# Altium project interface_com_usuario.PrjPcb
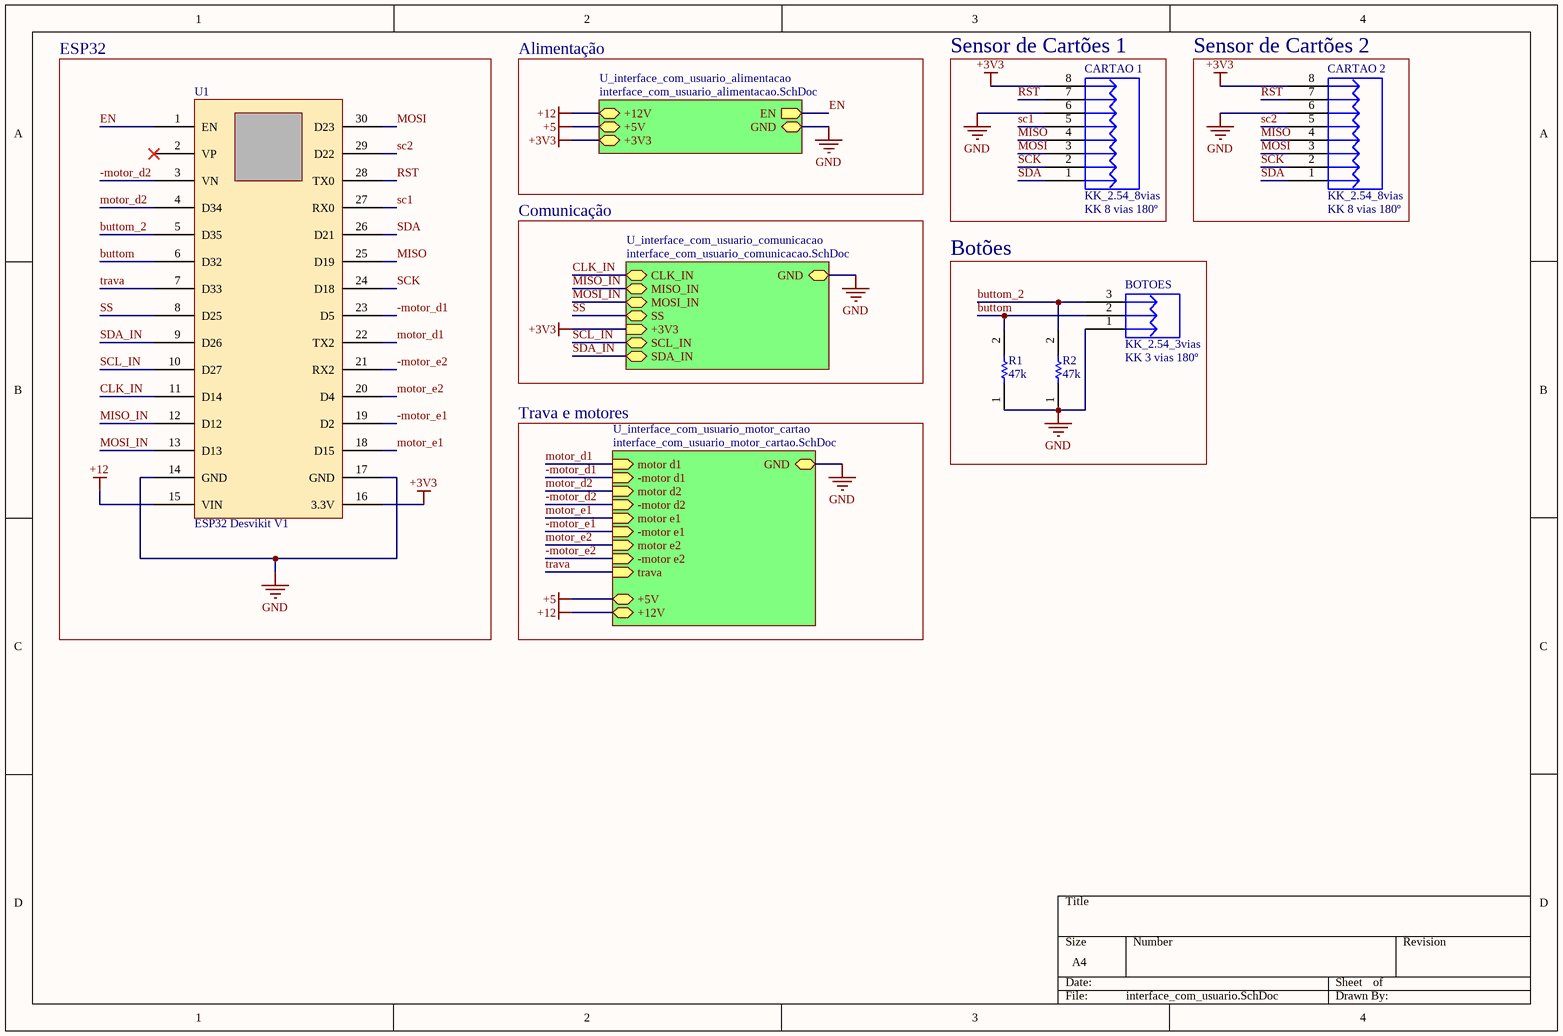
[diagram p0: interface_com_usuario.SchDoc]
4 sheets, 31 parts. Net scope: hierarchical (ports join the sheet entries above them; power ports are global).
Board file: interface_com_usuario.PcbDoc
Sheets:
  interface_com_usuario.SchDoc
    U_interface_com_usuario_alimentacao = interface_com_usuario_alimentacao.SchDoc
    U_interface_com_usuario_comunicacao = interface_com_usuario_comunicacao.SchDoc
    U_interface_com_usuario_motor_cartao = interface_com_usuario_motor_cartao.SchDoc

## Sheet interface_com_usuario.SchDoc
size A4; SheetNumber: 1; SheetTotal: 4

### Parts
BOTOES  KK_2.54_3vias  Valor: KK 3 vias 180º  [KK_3vias_180º]
CARTAO_1  KK_2.54_8vias  Valor: KK 8 vias 180º  [KK_8vias_180°]
CARTAO_2  KK_2.54_8vias  Valor: KK 8 vias 180º  [KK_8vias_180°]
R1  47k  [RESC3216X60N]
R2  47k  [RESC3216X60N]
U1  value ESP32 Desvikit V1  [ESP32_Desvikit_v1]  (hidden comment: microcontrolador)

### Blocks framed on the sheet
ESP32: U1
Sensor de Cartões 1: CARTAO_1
Sensor de Cartões 2: CARTAO_2
Botões: BOTOES R1 R2

### Sub-sheets
U_interface_com_usuario_alimentacao = interface_com_usuario_alimentacao.SchDoc: EN (out), GND (bidir), +12V (bidir), +5V (bidir), +3V3 (bidir)
U_interface_com_usuario_comunicacao = interface_com_usuario_comunicacao.SchDoc: CLK_IN (bidir), MISO_IN (bidir), MOSI_IN (bidir), SS (bidir), GND (bidir), +3V3 (in), SCL_IN (bidir), SDA_IN (bidir)
U_interface_com_usuario_motor_cartao = interface_com_usuario_motor_cartao.SchDoc: motor d1 (in), -motor d1 (in), motor d2 (in), -motor d2 (in), motor e1 (in), -motor e1 (in), motor e2 (in), -motor e2 (in), trava (in), GND (bidir), +5V (bidir), +12V (bidir)

### Nets
+3V3: CARTAO_1.8 CARTAO_2.8 U1.16(3.3V) ; sheet U_interface_com_usuario_alimentacao/+3V3, sheet U_interface_com_usuario_comunicacao/+3V3
+5: sheet U_interface_com_usuario_alimentacao/+5V, sheet U_interface_com_usuario_motor_cartao/+5V  [project net +5V]
+12: U1.15(VIN) ; sheet U_interface_com_usuario_alimentacao/+12V, sheet U_interface_com_usuario_motor_cartao/+12V  [project net +12V]
GND: BOTOES.1 CARTAO_1.6 CARTAO_2.6 R1.1 R2.1 U1.14(GND) U1.17(GND) ; sheet U_interface_com_usuario_alimentacao/GND, sheet U_interface_com_usuario_comunicacao/GND, sheet U_interface_com_usuario_motor_cartao/GND
-motor_d1: U1.23(D5) ; sheet U_interface_com_usuario_motor_cartao/-motor d1
-motor_d2: U1.3(VN) ; sheet U_interface_com_usuario_motor_cartao/-motor d2
-motor_e1: U1.19(D2) ; sheet U_interface_com_usuario_motor_cartao/-motor e1
-motor_e2: U1.21(RX2) ; sheet U_interface_com_usuario_motor_cartao/-motor e2
buttom: BOTOES.2 R1.2 U1.6(D32)
buttom_2: BOTOES.3 R2.2 U1.5(D35)
CLK_IN: U1.11(D14) ; sheet U_interface_com_usuario_comunicacao/CLK_IN
EN: U1.1(EN) ; sheet U_interface_com_usuario_alimentacao/EN
MISO: CARTAO_1.4 CARTAO_2.4 U1.25(D19)
MISO_IN: U1.12(D12) ; sheet U_interface_com_usuario_comunicacao/MISO_IN
MOSI: CARTAO_1.3 CARTAO_2.3 U1.30(D23)
MOSI_IN: U1.13(D13) ; sheet U_interface_com_usuario_comunicacao/MOSI_IN
motor_d1: U1.22(TX2) ; sheet U_interface_com_usuario_motor_cartao/motor d1
motor_d2: U1.4(D34) ; sheet U_interface_com_usuario_motor_cartao/motor d2
motor_e1: U1.18(D15) ; sheet U_interface_com_usuario_motor_cartao/motor e1
motor_e2: U1.20(D4) ; sheet U_interface_com_usuario_motor_cartao/motor e2
RST: CARTAO_1.7 CARTAO_2.7 U1.28(TX0)
sc1: CARTAO_1.5 U1.27(RX0)
sc2: CARTAO_2.5 U1.29(D22)
SCK: CARTAO_1.2 CARTAO_2.2 U1.24(D18)
SCL_IN: U1.10(D27) ; sheet U_interface_com_usuario_comunicacao/SCL_IN
SDA: CARTAO_1.1 CARTAO_2.1 U1.26(D21)
SDA_IN: U1.9(D26) ; sheet U_interface_com_usuario_comunicacao/SDA_IN
SS: U1.8(D25) ; sheet U_interface_com_usuario_comunicacao/SS
trava: U1.7(D33) ; sheet U_interface_com_usuario_motor_cartao/trava

Not connected (* = marked no-connect by the designer): U1 2(VP)*

### Notes on the sheet
- Alimentação
- Comunicação
- Trava e motores

### Library data of the parts
BOTOES = KK_2.54_3vias: Conector KK 2.54mm 3 vias; Descrição: Conector KK 3 vias com passo 2.54mm; Encapsulamento: PTH - 180º; Modelo: 3 vias - 180º; Marca: *; Observação: *
CARTAO_1 CARTAO_2 = KK_2.54_8vias: Conector KK 2.54mm 8 vias; Descrição: Conector KK 3 vias com passo 2.54mm; Encapsulamento: PTH - 180º; Modelo: 3 vias - 180º; Marca: *; Observação: *
R1 R2 = RES 1206: RES 1206 5%; Manufacturer_Name: Vishay; Manufacturer_Part_Number: CRCW12064K70FKEA; Datasheet Link: http://docs-emea.rs-online.com/webdocs/13ec/0900766b813ecc08.pdf; Height: 0.6mm; Mouser Part Number: 71-CRCW1206-4.7K-E3; Mouser Price/Stock: https://www.mouser.co.uk/ProductDetail/Vishay-Dale/CRCW12064K70FKEA?qs=1vm4qhDHCvlKJmatsKzyFQ%3D%3D; Arrow Part Number: CRCW12064K70FKEA; Arrow Price/Stock: https://www.arrow.com/en/products/crcw12064k70fkea/vishay
U1 = ESP32 Desvikit v1: microcontrolador com moculo bluethoth e wifi

## Sheet interface_com_usuario_alimentacao.SchDoc
size A4; SheetNumber: 2; SheetTotal: 4
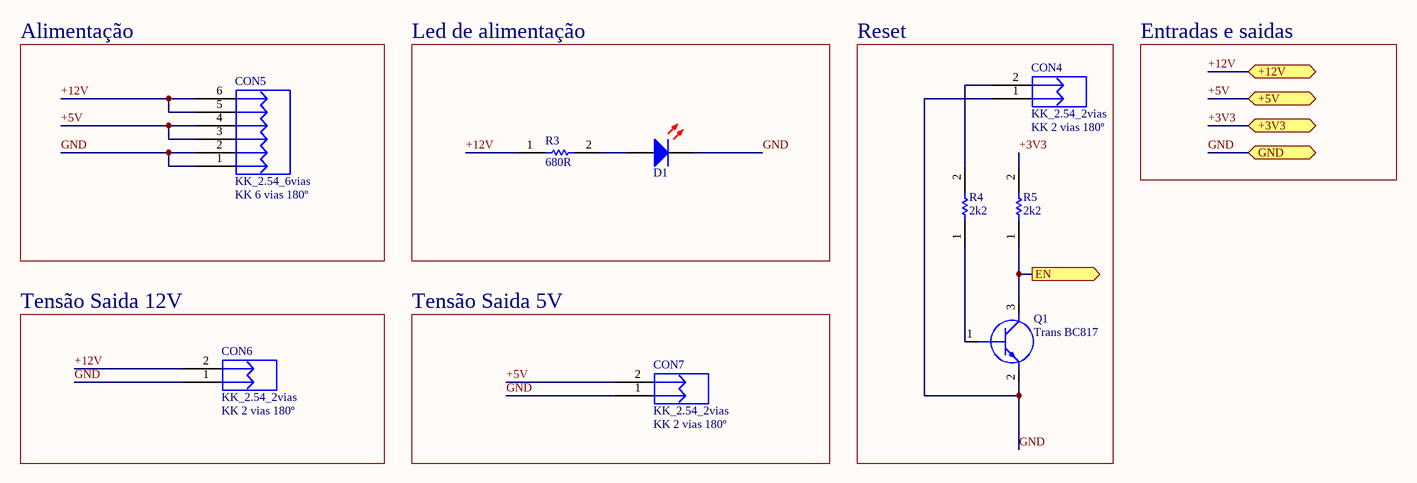
[diagram p1: interface_com_usuario_alimentacao.SchDoc]

### Parts
CON4  KK_2.54_2vias  Valor: KK 2 vias 180º  [KK_2VIAS_180º]
CON5  KK_2.54_6vias  Valor: KK 6 vias 180º  [KK_6vias_180°]
CON6  KK_2.54_2vias  Valor: KK 2 vias 180º  [KK_2VIAS_180º]
CON7  KK_2.54_2vias  Valor: KK 2 vias 180º  [KK_2VIAS_180º]
D1  LED 3MM RED  [LED RED]  (value not drawn)
Q1  Trans BC817  [SOT96P240X110-3N]
R3  680R  [RESC3216X60N]
R4  2k2  [RESC3216X60N]
R5  2k2  [RESC3216X60N]

### Blocks framed on the sheet
Alimentação: CON5
Led de alimentação: D1 R3
Reset: CON4 Q1 R4 R5
Tensão Saida 12V: CON6
Tensão Saida 5V: CON7

### Ports
+3V3 (bidir), +5V (bidir), +12V (bidir), EN (out), GND (bidir)

### Nets
+3V3: R5.2 ; port +3V3
+5V: CON5.3 CON5.4 CON7.2 ; port +5V
+12V: CON5.5 CON5.6 CON6.2 R3.1 ; port +12V
GND: CON4.1 CON5.1 CON5.2 CON6.1 CON7.1 D1.2(K) Q1.2(E) ; port GND
EN: Q1.3(C) R5.1 ; port EN
NetCON4_2: CON4.2 R4.2
NetD1_1: D1.1(A) R3.2
NetQ1_1: Q1.1(B) R4.1

### Notes on the sheet
- Entradas e saidas

### Library data of the parts
CON4 CON6 CON7 = KK_2.54_2vias: Conector KK 2.54mm 2 vias; Descrição: Conector KK 3 vias com passo 2.54mm; Encapsulamento: PTH - 180º; Modelo: 2 vias - 180º; Marca: *; Observação: *
CON5 = KK_2.54_6vias: Conector KK 2.54mm 6 vias; Descrição: Conector KK 3 vias com passo 2.54mm; Encapsulamento: PTH - 180º; Modelo: 3 vias - 180º; Marca: *; Observação: *
D1 = LED 3MM RED: Manufacturer: Paralight; Manufacturer Part Number: IMP585; Wavelength Typ: 625; Forward Voltage: 2; Forward Current If: 20; Luminous Intensity: 3; LED Mounting: Through Hole; Lens Shape: Round; Viewing Angle: 60°; SVHC: No SVHC (15-Jun-2015); External Diameter: 2.9; External Length / Height: 4.6; Forward Voltage VF Max: 2.5; LED / Lamp Size: 3mm / T-1; LED Type: Standard; Lead Cross-section Depth: 0.5; Luminous Intensity @ If Min: 0.7; PIV Max: 5; Peak Forward Current: 7; Voltage Vf Typ: 2.2V<!--FANDB--><div class="features-and-benefits-container"><div class="features-and-benefits-description"><span class="features-benefits-value">The L-934LID from Kingbright is a through hole round shape high efficiency red colour LED. The device is made of gallium arsenide phosphide on gallium phosphide orange light emitting diode. This LED is widely used because of low power consumption, long life and solid state reliability.</span></div><div class="features-and-benefits-list"><ul class="features-and-benefits-list-list"><li class="features-and-benefits-list-item">Standard bulb size of T-1 (3mm)</li><li class="features-and-benefits-list-item">Reliable and rugged</li><li class="features-and-benefits-list-item">Viewing angle is 60°</li><li class="features-and-benefits-list-item">Luminous intensity of 3mcd at 2mA</li><li class="features-and-benefits-list-item">Forward voltage is 2.0V</li><li class="features-and-benefits-list-item">Forward current (If) is 20mA</li><li class="features-and-benefits-list-item">Dominant wavelength is 625nm at IF=20mA</li><li class="features-and-benefits-list-item">Peak wavelength is 627nm at IF=20; Supplier 1: Mult Comercial; RoHS: YES; Stock 1: 35260; Pricing 1: 1=0.15 (BRL); LED Colour: Red; Bulb Size: 3mm; Packaging: Each; MSL: -; Current If Luminous Intensity: 2; Dominant Wavelength: 625; Forward Current If Max: 20; Lead Cross-section Width: 0.5; Lead Spacing: 2.54; Luminous Intensity Typ: 3; Mounting Type: PCB Through Hole; No. of Pins: 2; Operating Temperature Max: 85; Operating Temperature Min: -40; Operating Temperature Range: -40°C to +85; Peak Wavelength: 625; ComponentLink1URL: http://loja.multcomercial.com.br/led-3mm-vermelho-difuso-l-314hd-paralight.html; ComponentLink1Description: http://loja.multcomercial.com.br/led-3mm-vermelho-difuso-l-314hd-paralight.html; Supplier Part Number 1: Led 3mm Vermelho Difuso L-314HD - Paralight
Q1 = Trans BC817: Transistor BJT NPN BC817-25-7-F; Manufacturer_Name: Diodes Inc.; Datasheet Link: https://www.diodes.com/assets/Datasheets/ds11107.pdf; Height: 1.1mm; Manufacturer_Part_Number: BC817-25-7-F; Mouser Part Number: 621-BC817-25-7-F; Mouser Price/Stock: https://www.mouser.co.uk/ProductDetail/Diodes-Incorporated/BC817-25-7-F?qs=rGAXPo9uwV0jK0EyLZnqOw%3D%3D; Arrow Part Number: BC817-25-7-F; Arrow Price/Stock: https://www.arrow.com/en/products/bc817-25-7-f/diodes-incorporated
R3-R5 = Resistor 1206: Resistor; Manufacturer_Name: Vishay; Manufacturer_Part_Number: CRCW12064K70FKEA; Datasheet Link: http://docs-emea.rs-online.com/webdocs/13ec/0900766b813ecc08.pdf; Height: 0.6mm; Mouser Part Number: 71-CRCW1206-4.7K-E3; Mouser Price/Stock: https://www.mouser.co.uk/ProductDetail/Vishay-Dale/CRCW12064K70FKEA?qs=1vm4qhDHCvlKJmatsKzyFQ%3D%3D; Arrow Part Number: CRCW12064K70FKEA; Arrow Price/Stock: https://www.arrow.com/en/products/crcw12064k70fkea/vishay

## Sheet interface_com_usuario_comunicacao.SchDoc
size A4; SheetNumber: 3; SheetTotal: 4
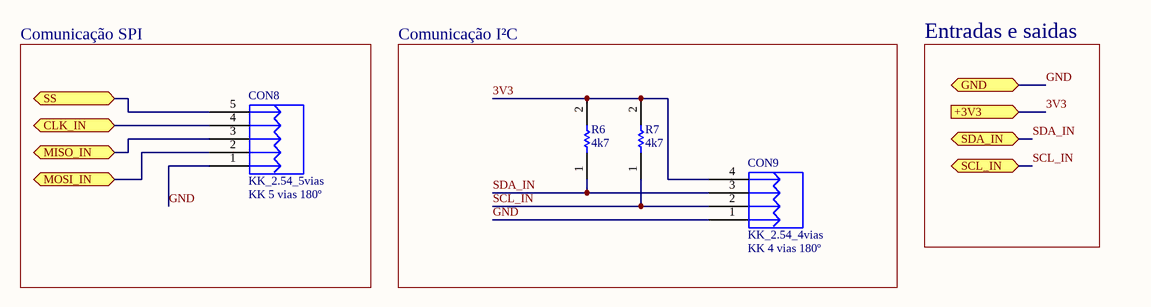
[diagram p2: interface_com_usuario_comunicacao.SchDoc]

### Parts
CON8  KK_2.54_5vias  Valor: KK 5 vias 180º  [KK_5vias_180°]
CON9  KK_2.54_4vias  Valor: KK 4 vias 180º  [KK_4vias_180°]
R6  4k7  [RESC3216X60N]
R7  4k7  [RESC3216X60N]

### Blocks framed on the sheet
Comunicação SPI: CON8
Comunicação I²C: CON9 R6 R7

### Ports
+3V3 (in), CLK_IN (bidir), GND (bidir), MISO_IN (bidir), MOSI_IN (bidir), SCL_IN (bidir), SDA_IN (bidir), SS (bidir)

### Nets
3V3: CON9.4 R6.2 R7.2 ; port +3V3  [project net +3V3]
GND: CON8.1 CON9.1 ; port GND
CLK_IN: CON8.4 ; port CLK_IN
MISO_IN: CON8.3 ; port MISO_IN
MOSI_IN: CON8.2 ; port MOSI_IN
SCL_IN: CON9.2 R7.1 ; port SCL_IN
SDA_IN: CON9.3 R6.1 ; port SDA_IN
SS: CON8.5 ; port SS

### Notes on the sheet
- Entradas e saidas

### Library data of the parts
CON8 = KK_2.54_5vias: Conector KK 2.54mm 5 vias; Descrição: Conector KK 3 vias com passo 2.54mm; Encapsulamento: PTH - 180º; Modelo: 3 vias - 180º; Marca: *; Observação: *
CON9 = KK_2.54_4vias: Conector KK 2.54mm 4 vias; Descrição: Conector KK 3 vias com passo 2.54mm; Encapsulamento: PTH - 180º; Modelo: 3 vias - 180º; Marca: *; Observação: *
R6 R7 = RES 1206: as R1 on sheet interface_com_usuario; Datasheet Link: http://docs-emea.rs-online.com/webdocs/13ec/0900766b813ecc08.pdf; Height: 0.6mm; Mouser Part Number: 71-CRCW1206-4.7K-E3; Mouser Price/Stock: https://www.mouser.co.uk/ProductDetail/Vishay-Dale/CRCW12064K70FKEA?qs=1vm4qhDHCvlKJmatsKzyFQ%3D%3D; Arrow Part Number: CRCW12064K70FKEA; Arrow Price/Stock: https://www.arrow.com/en/products/crcw12064k70fkea/vishay

## Sheet interface_com_usuario_motor_cartao.SchDoc
size A4; SheetNumber: 4; SheetTotal: 4
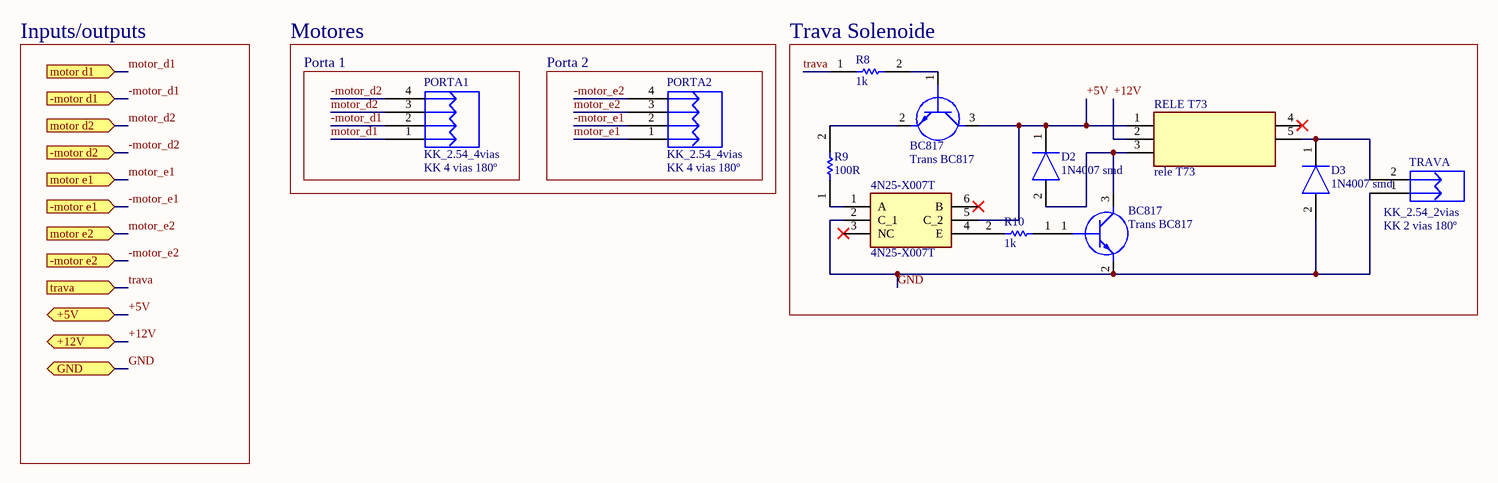
[diagram p3: interface_com_usuario_motor_cartao.SchDoc]

### Parts
(Parts that share a designator on the sheet are numbered #1, #2 ... from top to bottom, then left to right.)
4N25-X007T  4N25-X007T  [SOP254P1030X440-6N]
BC817#1  Trans BC817  [SOT96P240X110-3N]
BC817#2  Trans BC817  [SOT96P240X110-3N]
D2  1N4007 smd  [DIOM5327X242N]
D3  1N4007 smd  [DIOM5327X242N]
PORTA1  KK_2.54_4vias  Valor: KK 4 vias 180º  [KK_4vias_180°]
PORTA2  KK_2.54_4vias  Valor: KK 4 vias 180º  [KK_4vias_180°]
R8  1k  [RESC3216X60N]
R9  100R  [RESC3216X60N]
R10  1k  [RESC3216X60N]
RELE_T73  rele T73  [JQC3FT731Z12VDC]
TRAVA  KK_2.54_2vias  Valor: KK 2 vias 180º  [KK_2VIAS_180º]

### Blocks framed on the sheet
Trava Solenoide: 4N25-X007T BC817#1 BC817#2 D2 D3 R8-R10 RELE_T73 TRAVA
Porta 1: PORTA1
Porta 2: PORTA2

### Ports
+5V (bidir), +12V (bidir), -motor d1 (in), -motor d2 (in), -motor e1 (in), -motor e2 (in), GND (bidir), motor d1 (in), motor d2 (in), motor e1 (in), motor e2 (in), trava (in)

### Nets
+5V: 4N25-X007T.5(C_2) BC817#1.3(C) D2.1(K) RELE_T73.1(COIL_1) ; port +5V
+12V: RELE_T73.2(NC) ; port +12V
GND: 4N25-X007T.2(C_1) BC817#2.2(E) D3.2(A) TRAVA.1 ; port GND
-motor_d1: PORTA1.2 ; port -motor d1
-motor_d2: PORTA1.4 ; port -motor d2
-motor_e1: PORTA2.2 ; port -motor e1
-motor_e2: PORTA2.4 ; port -motor e2
motor_d1: PORTA1.1 ; port motor d1
motor_d2: PORTA1.3 ; port motor d2
motor_e1: PORTA2.1 ; port motor e1
motor_e2: PORTA2.3 ; port motor e2
trava: R8.1 ; port trava
Net4N25-X007T_1: 4N25-X007T.1(A) R9.1
Net4N25-X007T_4: 4N25-X007T.4(E) R10.2
NetBC817#1_1: BC817#1.1(B) R8.2
NetBC817#1_2: BC817#1.2(E) R9.2
NetBC817#2_1: BC817#2.1(B) R10.1
NetBC817#2_3: BC817#2.3(C) D2.2(A) RELE_T73.3(NO)
NetD3_1: D3.1(K) RELE_T73.5(COM) TRAVA.2

Not connected (* = marked no-connect by the designer): 4N25-X007T 3(NC)* 6(B)*; RELE_T73 4(COIL_2)*

### Notes on the sheet
- Inputs/outputs
- Motores

### Library data of the parts
4N25-X007T = 4N25-X007T: Phototransistor; Manufacturer_Name: Vishay; Datasheet Link: https://eu.mouser.com/datasheet/2/427/4n25x000-1767213.pdf; Height: 4.4mm; Manufacturer_Part_Number: 4N25-X007T; Mouser Part Number: 782-4N25-X007T; Mouser Price/Stock: https://www.mouser.com/Search/Refine.aspx?Keyword=782-4N25-X007T; Arrow Part Number: 4N25-X007T; Arrow Price/Stock: https://www.arrow.com/en/products/4n25-x007t/vishay
BC817#1 BC817#2 = Trans BC817: as Q1 on sheet interface_com_usuario_alimentacao; Datasheet Link: https://www.diodes.com/assets/Datasheets/ds11107.pdf; Height: 1.1mm; Manufacturer_Part_Number: BC817-25-7-F; Mouser Part Number: 621-BC817-25-7-F; Mouser Price/Stock: https://www.mouser.co.uk/ProductDetail/Diodes-Incorporated/BC817-25-7-F?qs=rGAXPo9uwV0jK0EyLZnqOw%3D%3D; Arrow Part Number: BC817-25-7-F; Arrow Price/Stock: https://www.arrow.com/en/products/bc817-25-7-f/diodes-incorporated
D2 D3 = 1N4007 smd: Diode smd; Manufacturer_Name: Shikues; Datasheet Link: https://datasheet.lcsc.com/szlcsc/SK-1N4007_C126233.pdf; Height: 2.42mm; Manufacturer_Part_Number: 1N4007
PORTA1 PORTA2 = KK_2.54_4vias: as CON9 on sheet interface_com_usuario_comunicacao; Marca: *; Observação: *
R8-R10 = RES 1206: as R1 on sheet interface_com_usuario; Datasheet Link: http://docs-emea.rs-online.com/webdocs/13ec/0900766b813ecc08.pdf; Height: 0.6mm; Mouser Part Number: 71-CRCW1206-4.7K-E3; Mouser Price/Stock: https://www.mouser.co.uk/ProductDetail/Vishay-Dale/CRCW12064K70FKEA?qs=1vm4qhDHCvlKJmatsKzyFQ%3D%3D; Arrow Part Number: CRCW12064K70FKEA; Arrow Price/Stock: https://www.arrow.com/en/products/crcw12064k70fkea/vishay
RELE_T73 = rele T73: Relay or Contactor; Manufacturer_Name: QIANJI; Manufacturer_Part_Number: JQC-3F-(T73)-1Z-12VDC; Datasheet Link: https://img.ozdisan.com/ETicaret_Dosya/341245_8627675.pdf; Height: 15.5mm
TRAVA = KK_2.54_2vias: as CON4 on sheet interface_com_usuario_alimentacao; Marca: *; Observação: *

## Nets that join several sheets
+3V3: interface_com_usuario (CARTAO_1.8 CARTAO_2.8 U1.16), interface_com_usuario_alimentacao (R5.2), interface_com_usuario_comunicacao (CON9.4 R6.2 R7.2)
+5V: interface_com_usuario_alimentacao (CON5.3 CON5.4 CON7.2), interface_com_usuario_motor_cartao (4N25-X007T.5 BC817#1.3 D2.1 RELE_T73.1)
+12V: interface_com_usuario (U1.15), interface_com_usuario_alimentacao (CON5.5 CON5.6 CON6.2 R3.1), interface_com_usuario_motor_cartao (RELE_T73.2)
GND: interface_com_usuario (7 pins), interface_com_usuario_alimentacao (7 pins), interface_com_usuario_comunicacao (CON8.1 CON9.1), interface_com_usuario_motor_cartao (4N25-X007T.2 BC817#2.2 D3.2 TRAVA.1)
-motor_d1: interface_com_usuario (U1.23), interface_com_usuario_motor_cartao (PORTA1.2)
-motor_d2: interface_com_usuario (U1.3), interface_com_usuario_motor_cartao (PORTA1.4)
-motor_e1: interface_com_usuario (U1.19), interface_com_usuario_motor_cartao (PORTA2.2)
-motor_e2: interface_com_usuario (U1.21), interface_com_usuario_motor_cartao (PORTA2.4)
CLK_IN: interface_com_usuario (U1.11), interface_com_usuario_comunicacao (CON8.4)
EN: interface_com_usuario (U1.1), interface_com_usuario_alimentacao (Q1.3 R5.1)
MISO_IN: interface_com_usuario (U1.12), interface_com_usuario_comunicacao (CON8.3)
MOSI_IN: interface_com_usuario (U1.13), interface_com_usuario_comunicacao (CON8.2)
motor_d1: interface_com_usuario (U1.22), interface_com_usuario_motor_cartao (PORTA1.1)
motor_d2: interface_com_usuario (U1.4), interface_com_usuario_motor_cartao (PORTA1.3)
motor_e1: interface_com_usuario (U1.18), interface_com_usuario_motor_cartao (PORTA2.1)
motor_e2: interface_com_usuario (U1.20), interface_com_usuario_motor_cartao (PORTA2.3)
SCL_IN: interface_com_usuario (U1.10), interface_com_usuario_comunicacao (CON9.2 R7.1)
SDA_IN: interface_com_usuario (U1.9), interface_com_usuario_comunicacao (CON9.3 R6.1)
SS: interface_com_usuario (U1.8), interface_com_usuario_comunicacao (CON8.5)
trava: interface_com_usuario (U1.7), interface_com_usuario_motor_cartao (R8.1)